# Altium schematic sheet MCU.SchDoc
size B; SheetNumber: 4; SheetTotal: 8
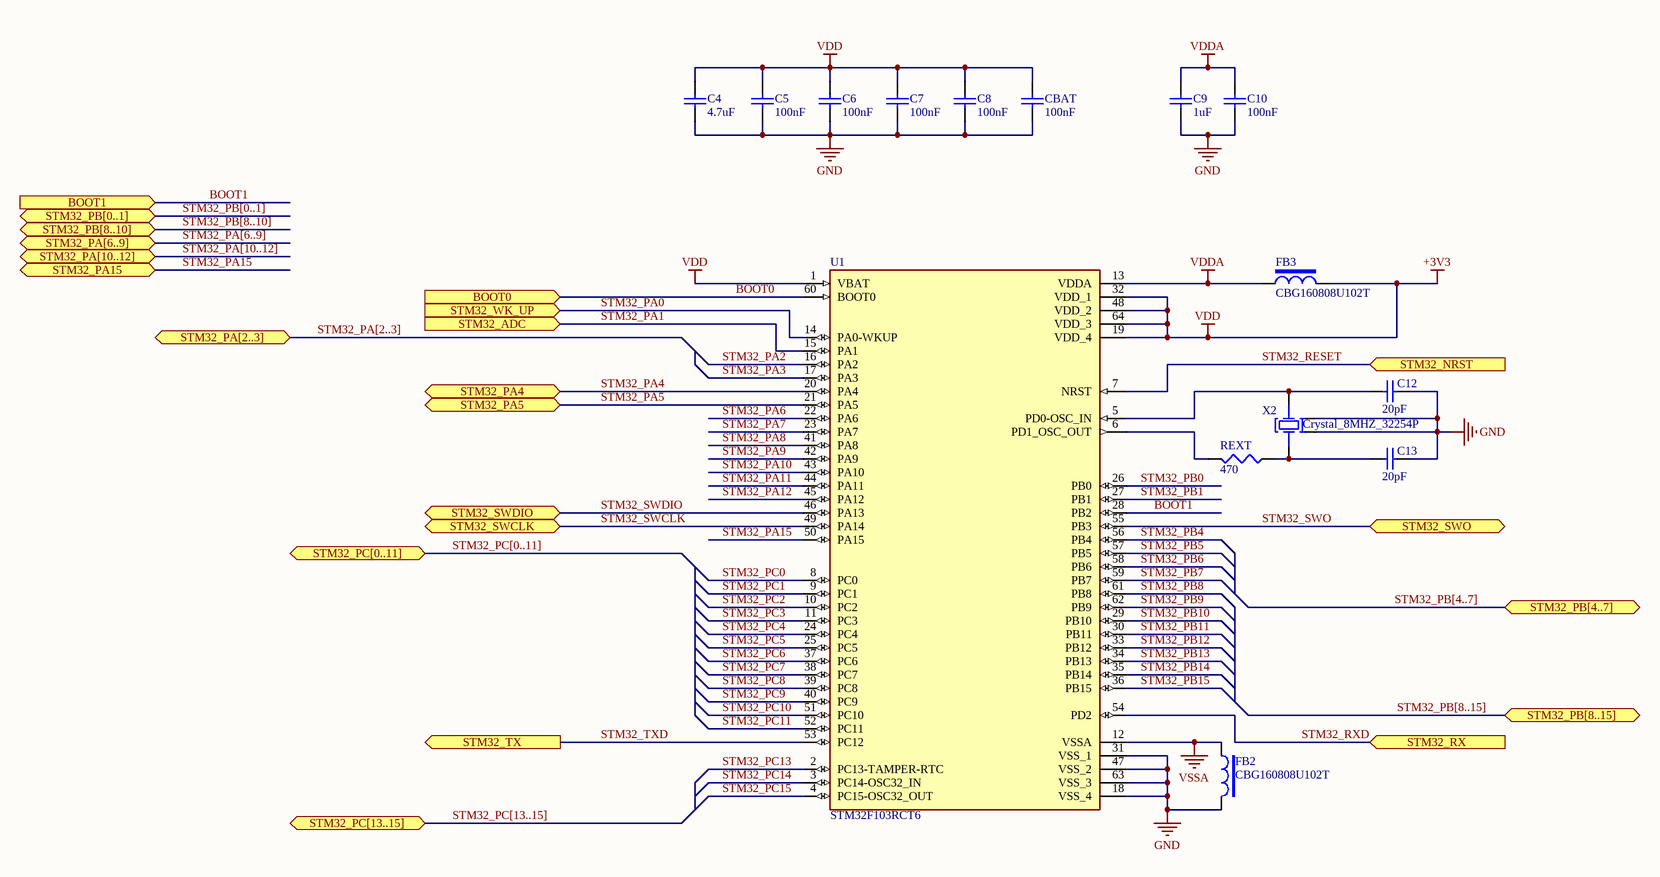
[diagram p0: MCU.SchDoc]

## Parts
C4  value 4.7uF  [CAPC0805(2012)145_L]  (hidden comment: 100nF)
C5  100nF  [CAPC0805(2012)145_L]
C6  100nF  [CAPC0805(2012)145_L]
C7  100nF  [CAPC0805(2012)145_L]
C8  100nF  [CAPC0805(2012)145_L]
C9  value 1uF  [CAPC0805(2012)145_L]  (hidden comment: 100nF)
C10  100nF  [CAPC0805(2012)145_L]
C12  value 20pF  [CAPC0805(2012)145_L]  (hidden comment: 22uF)
C13  value 20pF  [CAPC0805(2012)145_L]  (hidden comment: 22uF)
CBAT  100nF  [CAPC0805(2012)145_L]
FB2  CBG160808U102T  [0603]
FB3  CBG160808U102T  [0603]
REXT  value 470  [0805 (2012 Metric)]  (hidden comment: 220)
U1  STM32F103RCT6  [QFP50P1200X1200X160-64N]
X2  Crystal_8MHZ_32254P  [4-SMD, No Lead (3.2mm x 2.5mm)]

## Ports
BOOT0 (in), BOOT1 (in), STM32_ADC (in), STM32_NRST (in), STM32_PA4 (bidir), STM32_PA5 (bidir), STM32_PA15 (bidir), STM32_PA[2..3] (bidir), STM32_PA[6..9] (bidir), STM32_PA[10..12] (bidir), STM32_PB[0..1] (bidir), STM32_PB[4..7] (bidir), STM32_PB[8..10] (bidir), STM32_PB[8..15] (bidir), STM32_PC[0..11] (bidir), STM32_PC[13..15] (bidir), STM32_RX (in), STM32_SWCLK (bidir), STM32_SWDIO (bidir), STM32_SWO (bidir), STM32_TX (out), STM32_WK_UP (in)

## Nets
+3V3: C4.2 C5.2 C6.2 C7.2 C8.2 CBAT.2 FB3.2 U1.1(VBAT) U1.19(VDD_4) U1.32(VDD_1) U1.48(VDD_2) U1.64(VDD_3)  [also labelled VDD]
GND: C4.1 C5.1 C6.1 C7.1 C8.1 C9.1 C10.1 C12.2 C13.2 CBAT.1 FB2.2 U1.18(VSS_4) U1.31(VSS_1) U1.47(VSS_2) U1.63(VSS_3) X2.2(GND) X2.4(GND)
VDDA: C9.2 C10.2 FB3.1 U1.13(VDDA)
VSSA: FB2.1 U1.12(VSSA)
BOOT0: U1.60(BOOT0) ; port BOOT0
BOOT1: U1.28(PB2) ; port BOOT1
STM32_PA0: U1.14(PA0-WKUP) ; port STM32_WK_UP
STM32_PA1: U1.15(PA1) ; port STM32_ADC
STM32_PA2: U1.16(PA2)
STM32_PA3: U1.17(PA3)
STM32_PA4: U1.20(PA4) ; port STM32_PA4
STM32_PA5: U1.21(PA5) ; port STM32_PA5
STM32_PA6: U1.22(PA6)
STM32_PA7: U1.23(PA7)
STM32_PA8: U1.41(PA8)
STM32_PA9: U1.42(PA9)
STM32_PA10: U1.43(PA10)
STM32_PA11: U1.44(PA11)
STM32_PA12: U1.45(PA12)
STM32_PA15: U1.50(PA15) ; port STM32_PA15
STM32_PB0: U1.26(PB0)
STM32_PB1: U1.27(PB1)
STM32_PB4: U1.56(PB4)
STM32_PB5: U1.57(PB5)
STM32_PB6: U1.58(PB6)
STM32_PB7: U1.59(PB7)
STM32_PB8: U1.61(PB8)
STM32_PB9: U1.62(PB9)
STM32_PB10: U1.29(PB10)
STM32_PB11: U1.30(PB11)
STM32_PB12: U1.33(PB12)
STM32_PB13: U1.34(PB13)
STM32_PB14: U1.35(PB14)
STM32_PB15: U1.36(PB15)
STM32_PC0: U1.8(PC0)
STM32_PC1: U1.9(PC1)
STM32_PC2: U1.10(PC2)
STM32_PC3: U1.11(PC3)
STM32_PC4: U1.24(PC4)
STM32_PC5: U1.25(PC5)
STM32_PC6: U1.37(PC6)
STM32_PC7: U1.38(PC7)
STM32_PC8: U1.39(PC8)
STM32_PC9: U1.40(PC9)
STM32_PC10: U1.51(PC10)
STM32_PC11: U1.52(PC11)
STM32_PC13: U1.2(PC13-TAMPER-RTC)
STM32_PC14: U1.3(PC14-OSC32_IN)
STM32_PC15: U1.4(PC15-OSC32_OUT)
STM32_RESET: U1.7(NRST) ; port STM32_NRST
STM32_RXD: U1.54(PD2) ; port STM32_RX
STM32_SWCLK: U1.49(PA14) ; port STM32_SWCLK
STM32_SWDIO: U1.46(PA13) ; port STM32_SWDIO
STM32_SWO: U1.55(PB3) ; port STM32_SWO
STM32_TXD: U1.53(PC12) ; port STM32_TX
NetC12_1: C12.1 U1.5(PD0-OSC_IN) X2.3
NetC13_1: C13.1 REXT.1 X2.1
NetREXT_2: REXT.2 U1.6(PD1_OSC_OUT)

## Buses and harness runs
bus STM32_PA[2..3] = port STM32_PA[2..3]
bus STM32_PA[6..9] = port STM32_PA[6..9]
bus STM32_PA[10..12] = port STM32_PA[10..12]
bus STM32_PB[0..1] = port STM32_PB[0..1]
bus STM32_PB[4..7] = port STM32_PB[4..7]
bus STM32_PB[8..10] = port STM32_PB[8..10]
bus STM32_PB[8..15] = port STM32_PB[8..15]
bus STM32_PC[0..11] = port STM32_PC[0..11]
bus STM32_PC[13..15] = port STM32_PC[13..15]

## Library data of the parts
C4-C10 CBAT = CMP-001-00081-5: Chip Capacitor, 100nF +/-40%, 16V, 0805, Thickness 1.45 mm; Tolerance: 5%; Min Operating Temperature: -55°C; Case/Package: 0805; Pins: 2; Max Operating Temperature: 85°C; Voltage Rating: 16V; Mounting Technology: SMT
  C5-C8 C10 CBAT: Value: 100nF
C12 C13 = CMP-001-00081-5: Chip Capacitor, 22µF +/-40%, 16V, 0805, Thickness 1.45 mm; Tolerance: 5%; Min Operating Temperature: -55°C; Case/Package: 0805; Pins: 2; Max Operating Temperature: 85°C; Voltage Rating: 16V; Mounting Technology: SMT
FB2 FB3 = CMP-005-00013-18: Oreki; ComponentLink1Description: DigiKey; JLCPCB Part #: C98501; Source: components.SchLib
REXT = CMP-009-00179-13: Oreki; ComponentLink1Description: DigiKey; RoHS Compliant: Yes; Mounting Technology: SMT; Pins: 2; Case/Package: Chip
U1 = CMP-031-00008-7: ARMÂ® CortexÂ®-M3 STM32F1 Microcontroller IC 32-Bit 72MHz 256KB (256K x 8) FLASH 64-LQFP (10x10); MF: STMicroelectronics; Check_prices: https://www.snapeda.com/parts/STM32F103RCT6/STMicroelectronics/view-part/?ref=eda; Value: *; Design Item ID: STM32F103RCT6; Availability: In Stock; Source: STM32F103RCT6.SchLib; Purchase-URL: https://pricing.snapeda.com/search/part/STM32F103RCT6/?ref=eda; Component Type: Standard; SnapEDA_Link: https://www.snapeda.com/parts/STM32F103RCT6/STMicroelectronics/view-part/?ref=snap; Price: None; Pins: 64; MP: STM32F103RCT6; Case/Package: LQFP-64 STMicroelectronics; JLCPCB Part #: C8323
X2 = CMP-003-00036-1: SMD3225-4P; ComponentLink1Description: DigiKey; JLCPCB Part #: C2682774